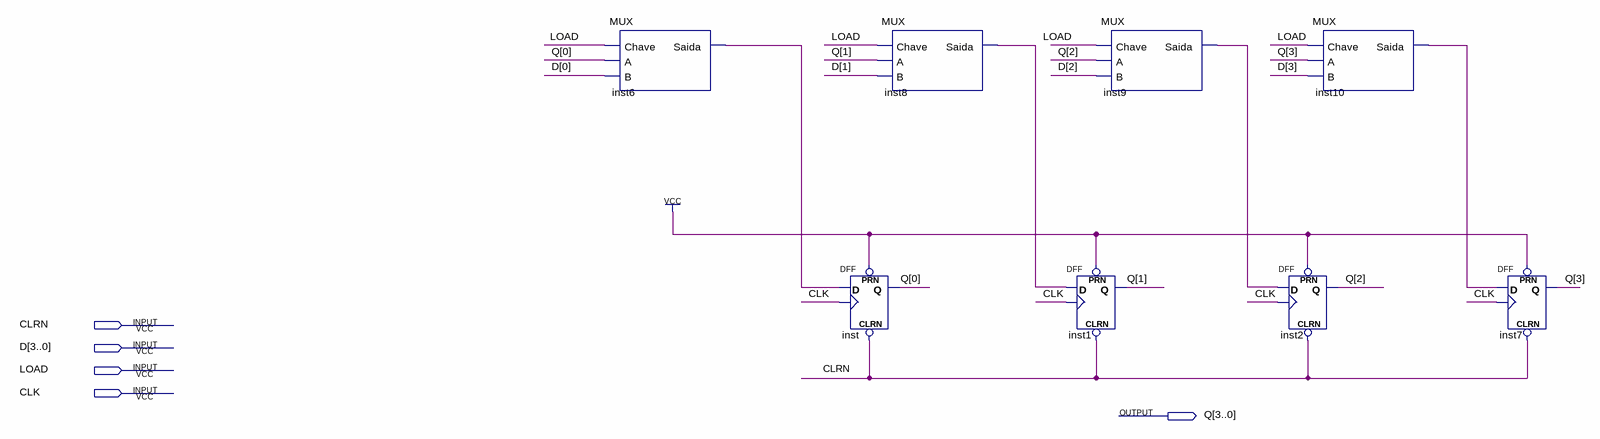
[diagram p0: schematic sheet]
// Quartus schematic registrador.bdf as structural Verilog: 8 symbols, 5 pins
module registrador (
  input  CLRN,
  input  [3:0] D,
  input  LOAD,
  input  CLK,
  output [3:0] Q
);

  wire inst6_saida, inst8_saida, inst9_saida, inst10_saida;

  MUX inst6 (.Chave(LOAD), .A(Q[0]), .B(D[0]), .Saida(inst6_saida));
  DFF inst (.CLRN(CLRN), .CLK(CLK), .D(inst6_saida), .PRN(1'b1), .Q(Q[0]));
  MUX inst8 (.Chave(LOAD), .A(Q[1]), .B(D[1]), .Saida(inst8_saida));
  MUX inst9 (.Chave(LOAD), .A(Q[2]), .B(D[2]), .Saida(inst9_saida));
  DFF inst1 (.CLRN(CLRN), .CLK(CLK), .D(inst8_saida), .PRN(1'b1), .Q(Q[1]));
  DFF inst2 (.CLRN(CLRN), .CLK(CLK), .D(inst9_saida), .PRN(1'b1), .Q(Q[2]));
  MUX inst10 (.Chave(LOAD), .A(Q[3]), .B(D[3]), .Saida(inst10_saida));
  DFF inst7 (.CLRN(CLRN), .CLK(CLK), .D(inst10_saida), .PRN(1'b1), .Q(Q[3]));
endmodule
